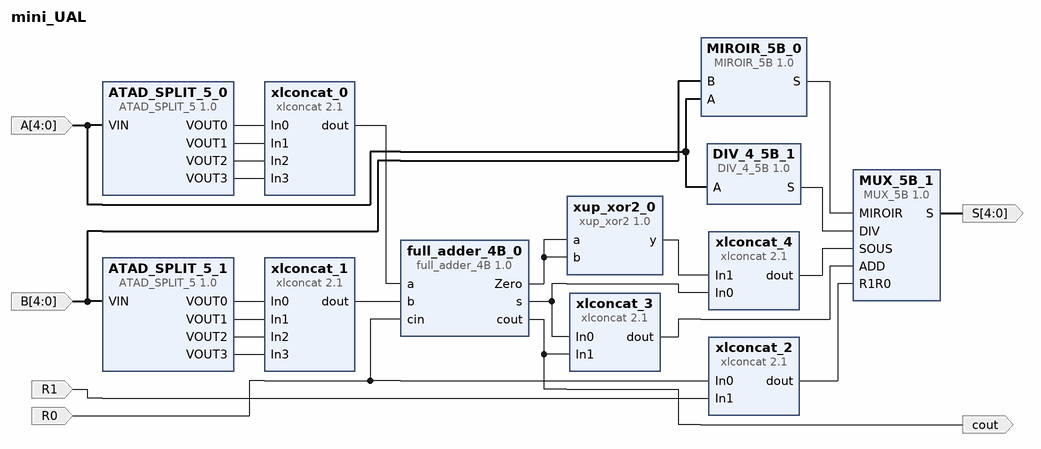
[diagram p0: block diagram of the top level]
# Vivado block design mini_UAL, xc7a100tcsg324-1, Vivado 2019.1
create_bd_design mini_UAL

create_bd_port -dir I -from 4 -to 0 A
create_bd_port -dir I -from 4 -to 0 B
create_bd_port -dir I R0
create_bd_port -dir I R1
create_bd_port -dir O cout
create_bd_port -dir O -from 4 -to 0 S

create_bd_cell -type ip -vlnv xilinx.com:xup:xup_xor2:1.0 xup_xor2_0
create_bd_cell -type ip -vlnv xilinx.com:ip:xlconcat:2.1 xlconcat_0
set_property -dict {CONFIG.NUM_PORTS 4} [get_bd_cells xlconcat_0]
create_bd_cell -type ip -vlnv xilinx.com:ip:xlconcat:2.1 xlconcat_1
set_property -dict {CONFIG.NUM_PORTS 4} [get_bd_cells xlconcat_1]
create_bd_cell -type ip -vlnv xilinx.com:ip:xlconcat:2.1 xlconcat_2
create_bd_cell -type ip -vlnv xilinx.com:ip:xlconcat:2.1 xlconcat_3
create_bd_cell -type ip -vlnv xilinx.com:user:ATAD_SPLIT_5:1.0 ATAD_SPLIT_5_0
create_bd_cell -type ip -vlnv xilinx.com:user:ATAD_SPLIT_5:1.0 ATAD_SPLIT_5_1
create_bd_cell -type ip -vlnv xilinx.com:user:MIROIR_5B:1.0 MIROIR_5B_0
create_bd_cell -type ip -vlnv xilinx.com:ip:xlconcat:2.1 xlconcat_4
create_bd_cell -type ip -vlnv xilinx.com:user:full_adder_4B:1.0 full_adder_4B_0
create_bd_cell -type ip -vlnv xilinx.com:user:MUX_5B:1.0 MUX_5B_1
create_bd_cell -type ip -vlnv xilinx.com:user:DIV_4_5B:1.0 DIV_4_5B_1

# ---- connections ----

connect_bd_net [get_bd_ports A] [get_bd_pins ATAD_SPLIT_5_0/VIN] [get_bd_pins MIROIR_5B_0/A] [get_bd_pins DIV_4_5B_1/A]
connect_bd_net [get_bd_ports B] [get_bd_pins ATAD_SPLIT_5_1/VIN] [get_bd_pins MIROIR_5B_0/B]
connect_bd_net [get_bd_pins ATAD_SPLIT_5_0/VOUT0] [get_bd_pins xlconcat_0/In0]
connect_bd_net [get_bd_pins ATAD_SPLIT_5_0/VOUT1] [get_bd_pins xlconcat_0/In1]
connect_bd_net [get_bd_pins ATAD_SPLIT_5_0/VOUT2] [get_bd_pins xlconcat_0/In2]
connect_bd_net [get_bd_pins ATAD_SPLIT_5_0/VOUT3] [get_bd_pins xlconcat_0/In3]
connect_bd_net [get_bd_pins ATAD_SPLIT_5_1/VOUT0] [get_bd_pins xlconcat_1/In0]
connect_bd_net [get_bd_pins ATAD_SPLIT_5_1/VOUT1] [get_bd_pins xlconcat_1/In1]
connect_bd_net [get_bd_pins ATAD_SPLIT_5_1/VOUT2] [get_bd_pins xlconcat_1/In2]
connect_bd_net [get_bd_pins ATAD_SPLIT_5_1/VOUT3] [get_bd_pins xlconcat_1/In3]
connect_bd_net -net R1_1 [get_bd_ports R1] [get_bd_pins xlconcat_2/In1]
connect_bd_net [get_bd_pins xlconcat_0/dout] [get_bd_pins full_adder_4B_0/a]
connect_bd_net -net R0_1 [get_bd_ports R0] [get_bd_pins xlconcat_2/In0] [get_bd_pins full_adder_4B_0/cin]
connect_bd_net [get_bd_pins xup_xor2_0/y] [get_bd_pins xlconcat_4/In1]
connect_bd_net [get_bd_pins xlconcat_1/dout] [get_bd_pins full_adder_4B_0/b]
connect_bd_net [get_bd_pins full_adder_4B_0/s] [get_bd_pins xlconcat_3/In0] [get_bd_pins xlconcat_4/In0]
connect_bd_net [get_bd_pins full_adder_4B_0/Zero] [get_bd_pins xup_xor2_0/b] [get_bd_pins xup_xor2_0/a]
connect_bd_net [get_bd_pins full_adder_4B_0/cout] [get_bd_ports cout] [get_bd_pins xlconcat_3/In1]
connect_bd_net [get_bd_pins xlconcat_3/dout] [get_bd_pins MUX_5B_1/ADD]
connect_bd_net [get_bd_pins xlconcat_4/dout] [get_bd_pins MUX_5B_1/SOUS]
connect_bd_net [get_bd_pins xlconcat_2/dout] [get_bd_pins MUX_5B_1/R1R0]
connect_bd_net [get_bd_pins MIROIR_5B_0/S] [get_bd_pins MUX_5B_1/MIROIR]
connect_bd_net [get_bd_pins MUX_5B_1/S] [get_bd_ports S]
connect_bd_net [get_bd_pins DIV_4_5B_1/S] [get_bd_pins MUX_5B_1/DIV]

validate_bd_design
save_bd_design
